# Altium schematic sheet Sensors.SchDoc: Flight Computer Prototype
size A4; Organization: Altium Limited; Address1: L3, 12a Rodborough Rd; Address2: Frenchs Forest; Address3: NSW; Address4: Australia 2086; Revision: 1.0; SheetNumber: 2; SheetTotal: 4
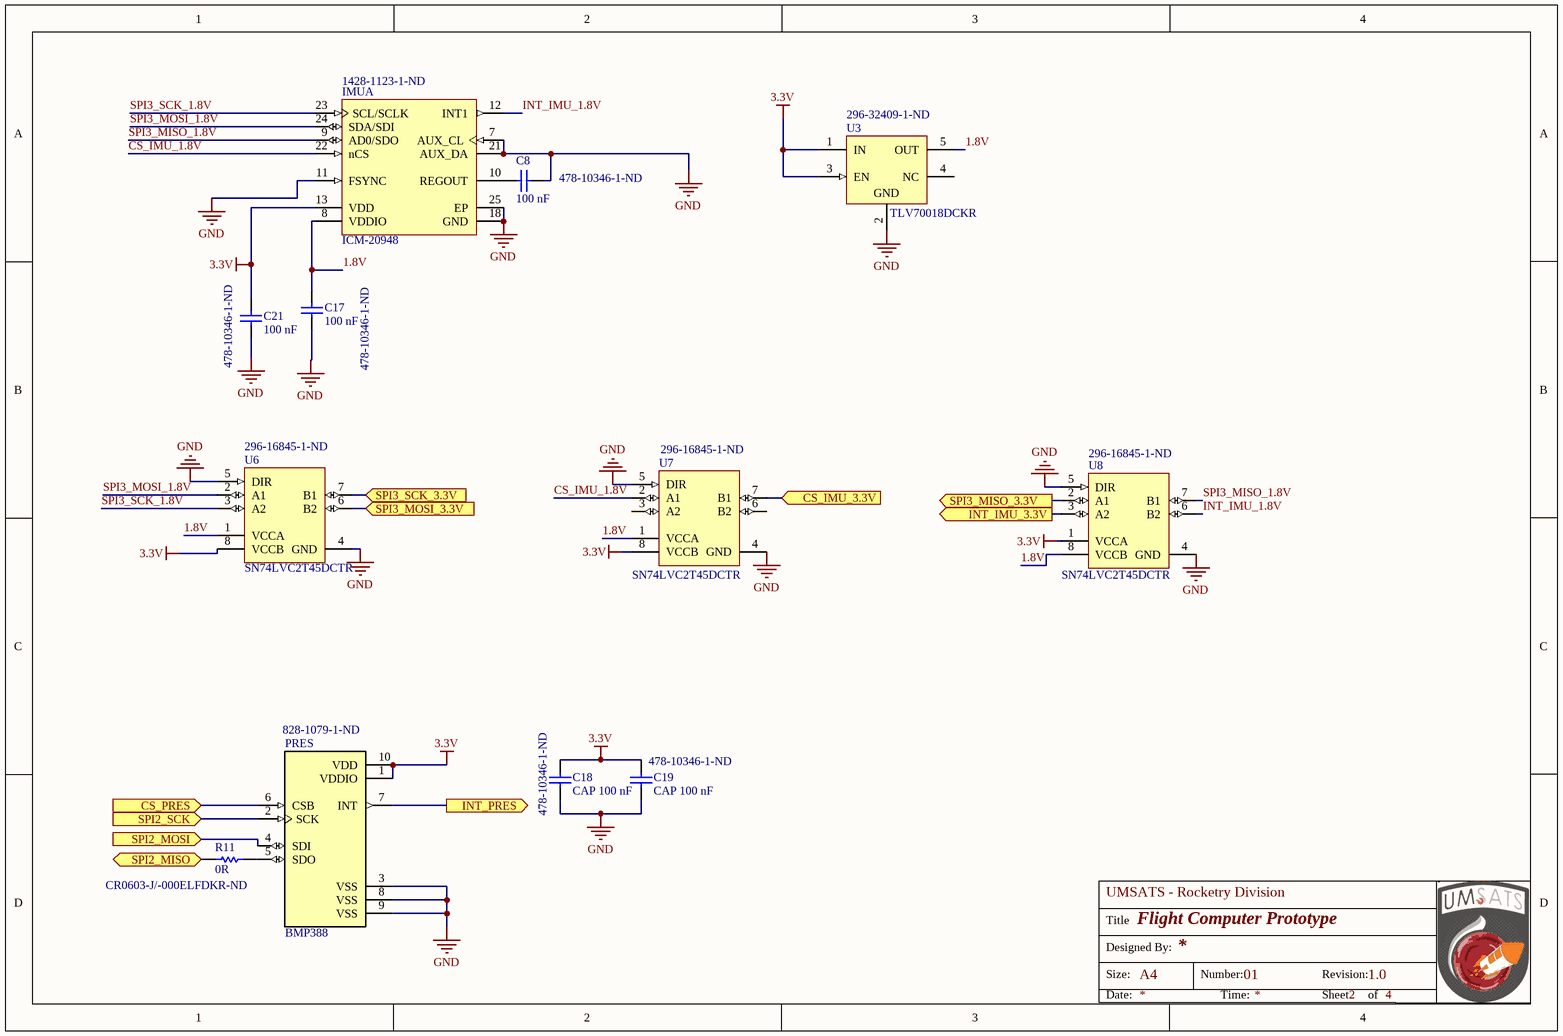
[diagram p0: Sensors.SchDoc]

## Parts
C8  100 nF  Supplier Part Number 1: 478-10346-1-ND  [CAPC1608X90X35ML15T15]
C17  100 nF  Supplier Part Number 1: 478-10346-1-ND  [CAPC1608X90X35ML15T15]
C18  CAP 100 nF  Supplier Part Number 1: 478-10346-1-ND  [06035C104KAT4A]
C19  CAP 100 nF  Supplier Part Number 1: 478-10346-1-ND  [06035C104KAT4A]
C21  100 nF  Supplier Part Number 1: 478-10346-1-ND  [CAPC1608X90X35ML15T15]
IMU  ICM-20948  Supplier Part Number 1: 1428-1123-1-ND  [TDK-QFN-24_L]  (part A of 2)
PRES  BMP388  Supplier Part Number 1: 828-1079-1-ND  [*PQFN50P200X200X80-10N]
R11  0R  Supplier Part Number 1: CR0603-J/-000ELFDKR-ND  [CR0603-J/-000ELF]
U3  TLV70018DCKR  Supplier Part Number 1: 296-32409-1-ND  [DCK0005A_N]
U6  SN74LVC2T45DCTR  Supplier Part Number 1: 296-16845-1-ND  [DCU0008A_N]
U7  SN74LVC2T45DCTR  Supplier Part Number 1: 296-16845-1-ND  [DCU0008A_N]
U8  SN74LVC2T45DCTR  Supplier Part Number 1: 296-16845-1-ND  [DCU0008A_N]

## Ports
CS_IMU_3.3V (in), CS_PRES (in), INT_IMU_3.3V (out), INT_PRES (out), SPI2_MISO (bidir), SPI2_MOSI (in), SPI2_SCK (in), SPI3_MISO_3.3V (out), SPI3_MOSI_3.3V (in), SPI3_SCK_3.3V (in)

## Nets
3.3V: C18.1 C19.1 C21.2 IMU.13(VDD) PRES.1(VDDIO) PRES.10(VDD) U3.1(IN) U3.3(EN) U6.8(VCCB) U7.8(VCCB) U8.1(VCCA)
GND: C8.2 C17.1 C18.2 C19.2 C21.1 IMU.7(AUX_CL) IMU.11(FSYNC) IMU.18(GND) IMU.21(AUX_DA) IMU.25(EP) PRES.3(VSS) PRES.8(VSS) PRES.9(VSS) U3.2(GND) U6.4(GND) U6.5(DIR) U7.4(GND) U7.5(DIR) U8.4(GND) U8.5(DIR)
1.8V: C17.2 IMU.8(VDDIO) U3.5(OUT) U6.1(VCCA) U7.1(VCCA) U8.8(VCCB)
CS_IMU_1.8V: IMU.22(nCS) U7.2(A1)
CS_IMU_3.3V: U7.7(B1) ; port CS_IMU_3.3V
CS_PRES: PRES.6(CSB) ; port CS_PRES
INT_IMU_1.8V: IMU.12(INT1) U8.6(B2)
INT_IMU_3.3V: U8.3(A2) ; port INT_IMU_3.3V
INT_PRES: PRES.7(INT) ; port INT_PRES
SPI2_MISO: R11.1 ; port SPI2_MISO
SPI2_MOSI: PRES.4(SDI) ; port SPI2_MOSI
SPI2_SCK: PRES.2(SCK) ; port SPI2_SCK
SPI3_MISO_1.8V: IMU.9(AD0/SDO) U8.7(B1)
SPI3_MISO_3.3V: U8.2(A1) ; port SPI3_MISO_3.3V
SPI3_MOSI_1.8V: IMU.24(SDA/SDI) U6.2(A1)
SPI3_MOSI_3.3V: U6.6(B2) ; port SPI3_MOSI_3.3V
SPI3_SCK_1.8V: IMU.23(SCL/SCLK) U6.3(A2)
SPI3_SCK_3.3V: U6.7(B1) ; port SPI3_SCK_3.3V
NetC8_1: C8.1 IMU.10(REGOUT)
NetPRES_5: PRES.5(SDO) R11.2

Not connected (* = marked no-connect by the designer): U3 4(NC); U7 3(A2) 6(B2)

## Notes on the sheet
- Title
- UMSATS - Rocketry Division
- Designed By:
- Size:
- A4
- Number:
- 01
- Revision:
- Date:
- Time:
- Sheet
- of

## Library data of the parts
C8 C17 C21 = CMP-2006-04388-1: Part Number: 06035C104K4Z2A; Manufacturer: AVX Interconnect / Elco; Supplier 1: Digi-Key
C18 C19 = Cap: Capacitor; Published: 8-Jun-2000; LatestRevisionDate: 17-Jul-2002; LatestRevisionNote: Re-released for DXP Platform.; Publisher: Altium Limited; Supplier 1: Digi-Key
IMU = CMP-2000-07532-1: World’s Lowest Power 9-Axis MEMS MotionTracking(TM) Device, 1.71 to 3.6 V, -40 to 85 degC, 24-Pin QFN, RoHS, Tape and Reel; Manufacturer: TDK; Package Description: 24-Pin Quad Flat No-lead Package, Body 3 x 3 mm, Pitch 0.4 mm; Datasheet Version: Rev. 1.3, 06/2017; Package Reference: QFN-24; Mounting Technology: SurfaceMount; Datasheet URL: https://www.invensense.com/wp-content/uploads/2016/06/DS-000189-ICM-20948-v1.3.pdf; Manufacturer URL: http://www.tdk.com/; Supplier 1: Digi-Key
PRES = BMP388: P-Sensor SPI I2C 1, 25 Bar SMD; MF: Bosch Sensortec; Package: WFLGA-10 Bosch Tools; SnapEDA_Link: https://www.snapeda.com/parts/BMP388/Bosch%20Sensortec/view-part/?ref=snap; MP: BMP388; Availability: Unavailable; Price: None; Value: *; Supplier 1: Digi-Key
R11 = Res1: Resistor; Value: 1K; Published: 8-Jun-2000; LatestRevisionDate: 17-Jul-2002; LatestRevisionNote: Re-released for DXP Platform.; PackageReference: AXIAL-0.3; Publisher: Altium Limited; PackageDescription: Axial Device, Thru-Hole; 2 Leads; 0.3 in Pin Spacing; Supplier 1: Digi-Key
U3 = CMP-0394-00928-2: Single Output LDO, 200 mA, Fixed 1.8 V Output, 2 to 5.5 V Input, with Low IQ, 5-pin SC70 (DCK), -40 to 125 degC, Green (RoHS & no Sb/Br); Manufacturer: Texas Instruments; Vout Adj(Max)(V): 1.8; Vin(Max)(V): 5.5; SubFamily: Single Channel LDO; Iout(Max)(A): 0.2; Iq(Typ)(mA): 0.03; Accuracy(%): 2; Vdo(Typ)(mV): 175; PartNumber: TLV70018DCKR; ComponentLink3URL: http://www.ti.com/litv/pdf/mpds025f; ComponentLink1URL: http://www.ti.com/; PackageDescription: 5-Pin Plastic Small-Outline, Body 2 x 1.25 mm, Pitch 0.65 mm; DatasheetVersion: SLVSA00D; Eco-Plan: Green (RoHS & no Sb/Br); Mounting Technology: Surface Mount; ComponentLink2URL: http://www.ti.com/general/docs/lit/getliterature.tsp?genericPartNumber=TLV70018&fileType=pdf; ComponentLink3Description: Package Specification; Vout Adj(Min)(V): 1.8; ComponentLink1Description: Manufacturer URL; Code_JEDEC: MO-203; PackageReference: DCK0005A; ComponentLink2Description: Datasheet; Vin(Min)(V): 2; PackageVersion: 4093553-3/G; Fixed Output Options(V): 1.8; Supplier 1: Digi-Key
U6-U8 = CMP-0859-00011-4: Dual-Bit Dual Supply Transceiver with Configurable Voltage Translation and 3-State Outputs, DCU0008A, LARGE T&R; Manufacturer: Texas Instruments; Rating: Military; Output Type: CMOS; VCC(Max)(V): 5.5; tpd @ Nom Voltage(Max)(ns): 17.7,10.3,8.3,7.2; Technology Family: LVC; Schmitt Trigger: No; ICC @ Nom Voltage(Max)(mA): 0.004; Sub-Family: Dual Supply Translator; F @ Nom Voltage(Max)(Mhz): 150; Voltage(Nom)(V): 1.8,2.5,3.3,5; 3-State Output: Yes; Logic: True; Output Drive (IOL/IOH)(Max)(mA): 32/-32; Bits(#): 2; Input Type: CMOS/TTL; VCC(Min)(V): 1.65; DatasheetVersion: SCES516J; Operating Temperature Range(C): -40 to 85; Generic Part Number: SN74LVC2T45; PackageReference: DCU0008A; Supplier 1: Digi-Key